# Altium schematic sheet Supply.SchDoc
size A4
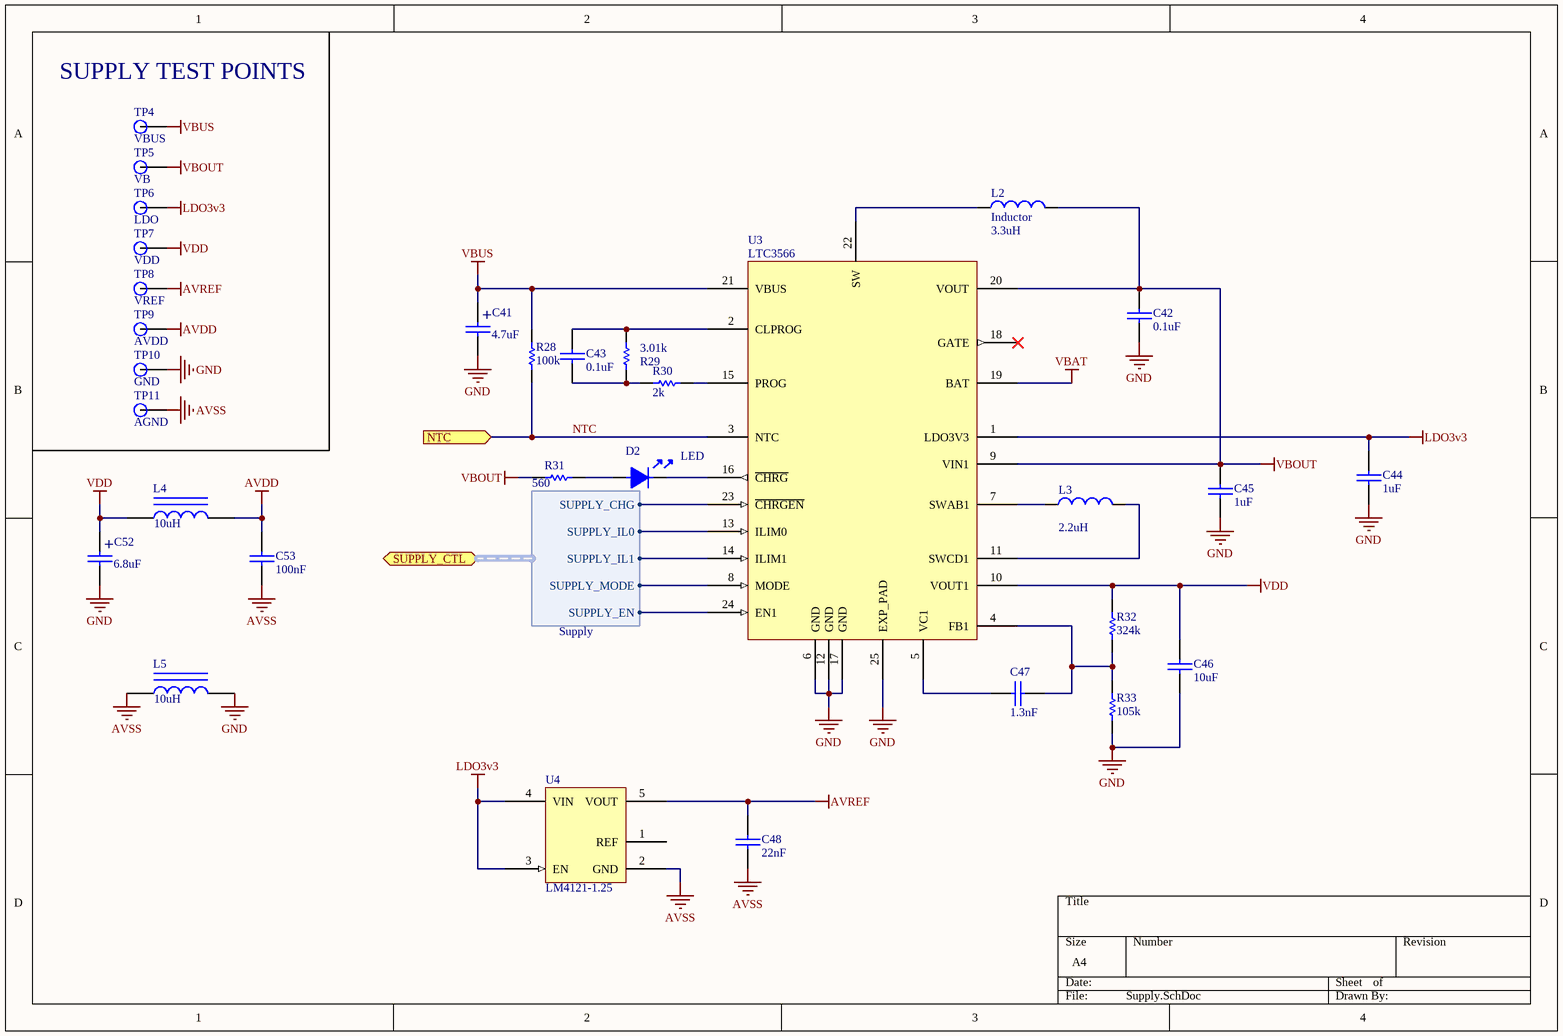
[diagram p0: Supply.SchDoc]

## Parts
C41  value 4.7uF  [1211 (3528)]  (hidden comment: CAPPOL)
C42  value 0.1uF  [0805]  (hidden comment: Capacitor)
C43  value 0.1uF  [0805]  (hidden comment: Capacitor)
C44  value 1uF  [0805]  (hidden comment: Capacitor)
C45  value 1uF  [0805]  (hidden comment: Capacitor)
C46  value 10uF  [0805]  (hidden comment: Capacitor)
C47  value 1.3nF  [0805]  (hidden comment: Capacitor)
C48  value 22nF  [0805]  (hidden comment: Capacitor)
C52  value 6.8uF  [1211 (3528)]  (hidden comment: CAPPOL)
C53  value 100nF  [0805]  (hidden comment: Capacitor)
D2  LED  [LED0805]
L2  Inductor  value 3.3uH  [0805]
L3  value 2.2uH  [0805]  (hidden comment: Inductor)
L4  value 10uH  [1206]  (hidden comment: Inductor Iron)
L5  value 10uH  [1206]  (hidden comment: Inductor Iron)
R28  value 100k  [0805]  (hidden comment: Resistor)
R29  value 3.01k  [0805]  (hidden comment: Resistor)
R30  value 2k  [0805]  (hidden comment: Resistor)
R31  value 560  [0805]  (hidden comment: Resistor)
R32  value 324k  [0805]  (hidden comment: Resistor)
R33  value 105k  [0805]  (hidden comment: Resistor)
TP4  VBUS  [PAD]
TP5  VB  [PAD]
TP6  LDO  [PAD]
TP7  VDD  [PAD]
TP8  VREF  [PAD]
TP9  AVDD  [PAD]
TP10  GND  [PAD]
TP11  AGND  [PAD]
U3  Part: LTC3566  [QFN24]  (hidden comment: Battery Charger)
U4  Part: LM4121-1.25  [SOT23-5]  (hidden comment: Voltage Reference)

## Ports
NTC (in), SUPPLY_CTL (harness Supply)

## Harnesses
Supply: SUPPLY_IL0, SUPPLY_EN, SUPPLY_MODE, SUPPLY_IL1, SUPPLY_CHG

## Nets
AVDD: C53.2 L4.2 TP9.1
AVREF: C48.2 TP8.1 U4.5(VOUT)
AVSS: C48.1 C53.1 L5.1 TP11.1 U4.2(GND)
GND: C41.2 C42.2 C44.1 C45.1 C46.2 C52.2 L5.2 R33.2 TP10.1 U3.6(GND) U3.12(GND) U3.17(GND) U3.25(EXP_PAD)
LDO3v3: C44.2 TP6.1 U3.1(LDO3V3) U4.3(EN) U4.4(VIN)
VBAT: U3.19(BAT)
VBOUT: C42.1 C45.2 L2.2 R31.2 TP5.1 U3.9(VIN1) U3.20(VOUT)
VBUS: C41.1 R28.1 TP4.1 U3.21(VBUS)
VDD: C46.1 C52.1 L4.1 R32.1 TP7.1 U3.10(VOUT1)
NTC: R28.2 U3.3(NTC) ; port NTC
NetC43_1: C43.1 R29.2 U3.2(CLPROG)
NetC43_2: C43.2 R29.1 R30.2
NetC47_1: C47.1 U3.5(VC1)
NetC47_2: C47.2 R32.2 R33.1 U3.4(FB1)
NetD2_1: D2.1 R31.1
NetD2_2: D2.2 U3.16(~{CHRG})
NetL2_1: L2.1 U3.22(SW)
NetL3_1: L3.1 U3.7(SWAB1)
NetL3_2: L3.2 U3.11(SWCD1)
NetR30_1: R30.1 U3.15(PROG)
NetU3_8: U3.8(MODE) ; port SUPPLY_CTL.SUPPLY_MODE
NetU3_13: U3.13(ILIM0) ; port SUPPLY_CTL.SUPPLY_IL0
NetU3_14: U3.14(ILIM1) ; port SUPPLY_CTL.SUPPLY_IL1
NetU3_23: U3.23(~{CHRGEN}) ; port SUPPLY_CTL.SUPPLY_CHG
NetU3_24: U3.24(EN1) ; port SUPPLY_CTL.SUPPLY_EN

Not connected (* = marked no-connect by the designer): U3 18(GATE)*; U4 1(REF)

## Notes on the sheet
- (near TP4) SUPPLY TEST POINTS
- (in symbol CAPPOL) +

## Library data of the parts
C41 = CAPPOL: Voltage Rating: 16v; Dielectric: X5R
C52 = CAPPOL: Voltage Rating: 16v; Dielectric: X7R
L2 L3 = Inductor: Code_IEC: 1005; Published: 8-Jun-2000; LatestRevisionDate: 29-May-2009; LatestRevisionNote: IPC-7351 Footprint Added.; PackageReference: 0402-A; Publisher: Altium Limited; PackageDescription: Chip Inductor; Code_JEITA: 0402
L4 L5 = Inductor Iron: Magnetic-Core Inductor; Published: 24-Mar-1999; LatestRevisionDate: 17-Jul-2002; LatestRevisionNote: Re-released for DXP Platform.; PackageReference: AXIAL-0.9; Publisher: Altium Limited
TP4-TP11 = Test Point
U3 = LT3566
C42-C48 C53 = Capacitor: Dielectric: *; Voltage: *